# Altium schematic sheet П МАСКИ а3.SchDoc
size 420 x 297 mm; Address1: Address1; Address2: Address2; Address3: Address3; Address4: Address4; SheetNumber: 1; Scale: 1:1; Номер листа: 5
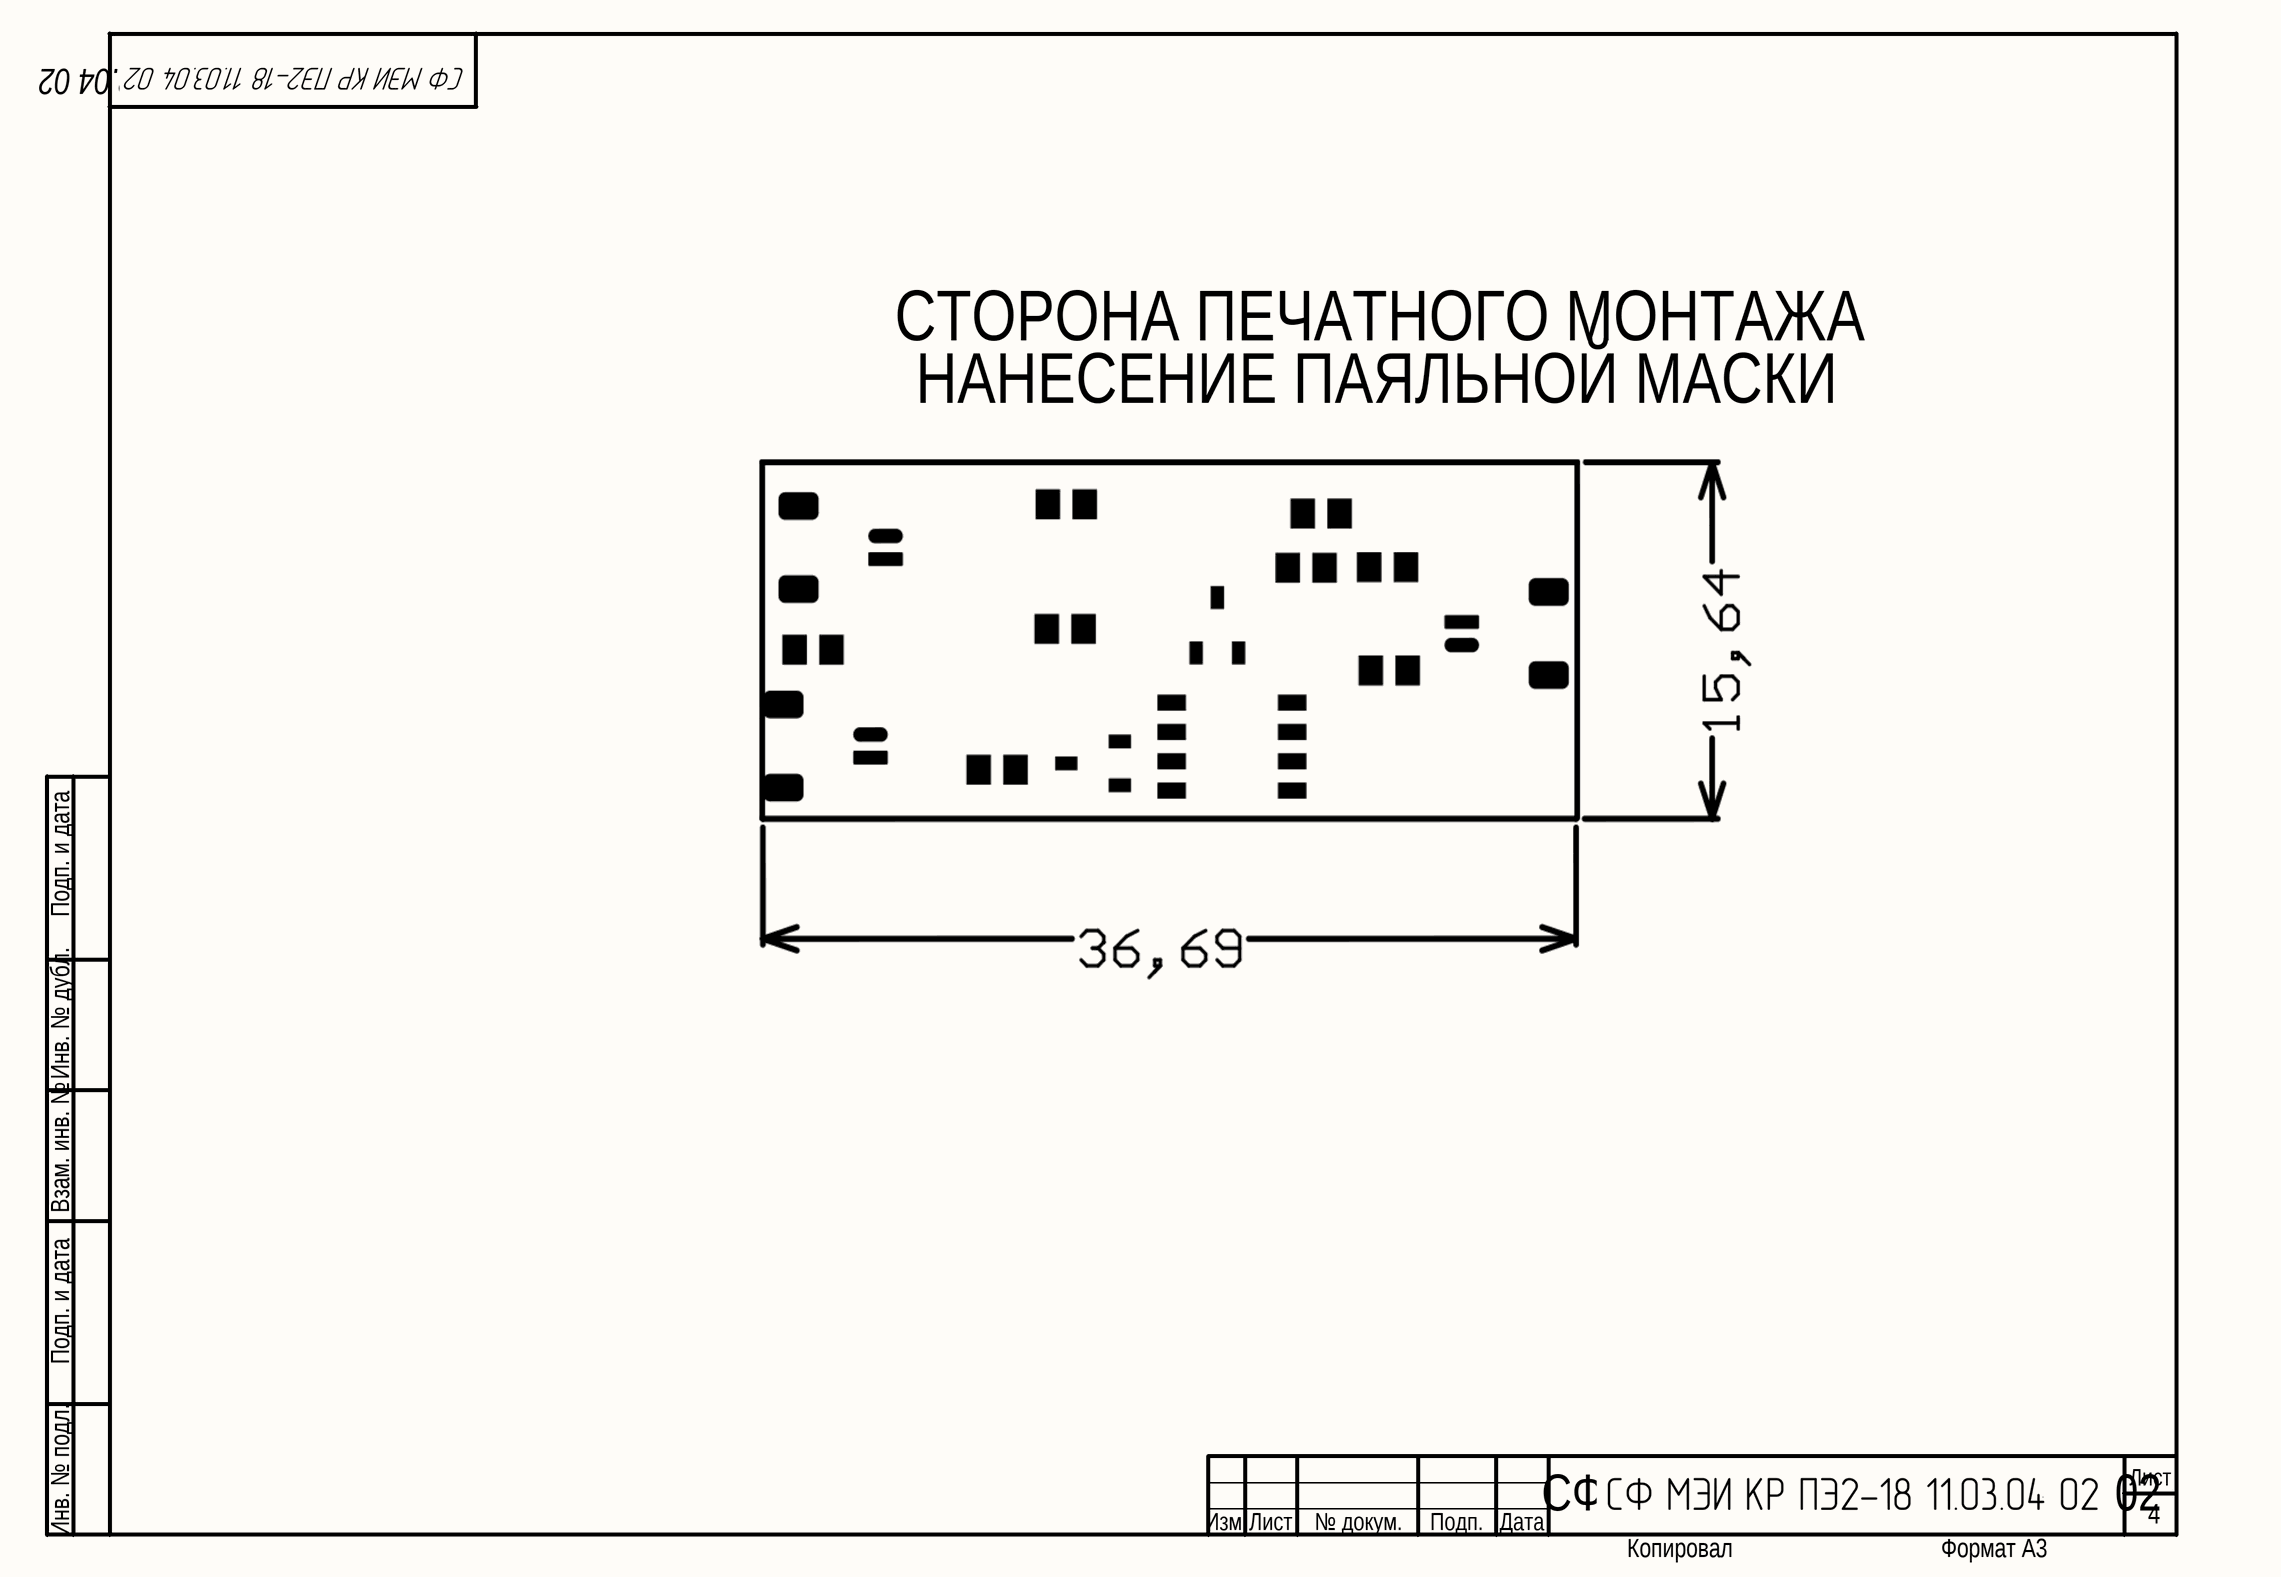
[diagram p0: П МАСКИ а3.SchDoc]

## Notes on the sheet
- СФ МЭИ КР ПЭ2-18 11.03.04 02
- СТОРОНА ПЕЧАТНОГО МОНТАЖА
- НАНЕСЕНИЕ ПАЯЛЬНОЙ МАСКИ
- Подп. и дата
- Инв. № дубл.
- Взам. инв. №
- Инв. № подл.
- Изм.
- Лист
- № докум.
- Подп.
- Дата
- .
- 4
- Копировал
- Формат А3